# EAGLE schematic untitled2 (EAGLE 9.6.1)
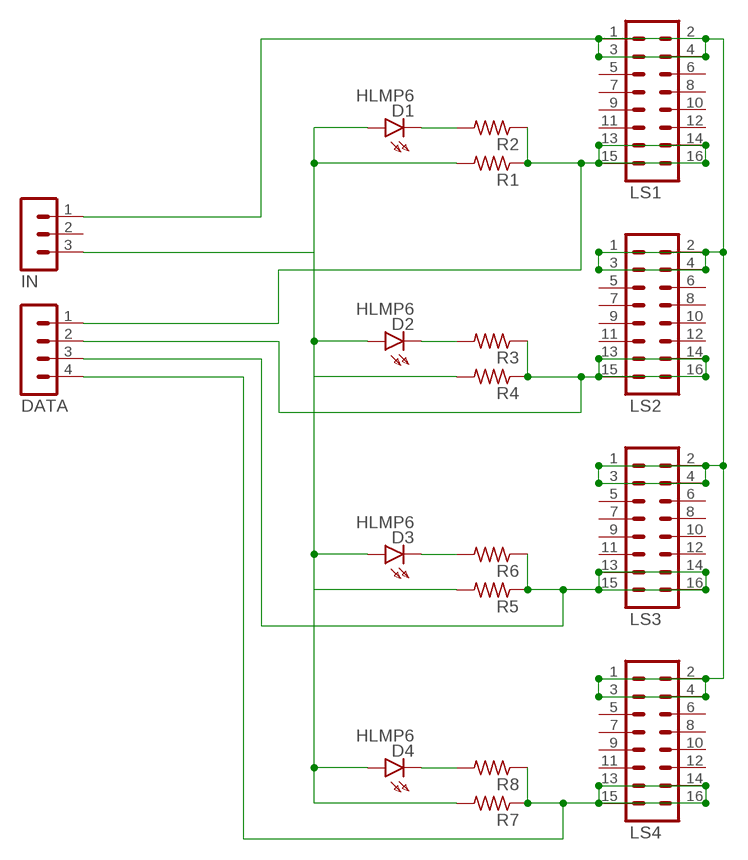
[diagram p0: schematic, sheet 1]

## Parts
D1  HLMP6  [HLMP6]
D2  HLMP6  [HLMP6]
D3  HLMP6  [HLMP6]
D4  HLMP6  [HLMP6]
DATA  MA04-1  [MA04-1]
IN  MA03-1  [MA03-1]
LS1  MA08-2  [MA08-2]
LS2  MA08-2  [MA08-2]
LS3  MA08-2  [MA08-2]
LS4  MA08-2  [MA08-2]
R1  R-US_0207/10  [0207/10]
R2  R-US_0207/10  [0207/10]
R3  R-US_0207/10  [0207/10]
R4  R-US_0207/10  [0207/10]
R5  R-US_0207/10  [0207/10]
R6  R-US_0207/10  [0207/10]
R7  R-US_0207/10  [0207/10]
R8  R-US_0207/10  [0207/10]

## Nets
GND: D1.A D2.A D3.A D4.A IN.3 R1.2 R4.2 R5.2 R7.2
N$1: DATA.1 LS1.13 LS1.14 LS1.15 LS1.16 R1.1 R2.1
N$2: D2.K R3.2
N$3: DATA.2 LS2.13 LS2.14 LS2.15 LS2.16 R3.1 R4.1
N$4: D3.K R6.2
N$5: D1.K R2.2
N$6: DATA.3 LS3.13 LS3.14 LS3.15 LS3.16 R5.1 R6.1
N$7: D4.K R8.2
N$8: DATA.4 LS4.13 LS4.14 LS4.15 LS4.16 R7.1 R8.1
N$9: IN.1 LS1.1 LS1.2 LS1.3 LS1.4 LS2.1 LS2.2 LS2.3 LS2.4 LS3.1 LS3.2 LS3.3 LS3.4 LS4.1 LS4.2 LS4.3 LS4.4
Unconnected: IN.2 LS1.5 LS1.6 LS1.7 LS1.8 LS1.9 LS1.10 LS1.11 LS1.12 LS2.5 LS2.6 LS2.7 LS2.8 LS2.9 LS2.10 LS2.11 LS2.12 LS3.5 LS3.6 LS3.7 LS3.8 LS3.9 LS3.10 LS3.11 LS3.12 LS4.5 LS4.6 LS4.7 LS4.8 LS4.9 LS4.10 LS4.11 LS4.12

## Library data of the parts
D1-D4 = display-hp:HLMP6: LED 2mm horizontal; MF: AGILENT TECHNOLOGIES; MPN: HLMP-6500; OC_FARNELL: 1652490; OC_NEWARK: 40K0088
DATA = con-lstb:MA04-1: PIN HEADER; OC_FARNELL: unknown; OC_NEWARK: unknown
IN = con-lstb:MA03-1: PIN HEADER; OC_FARNELL: unknown; OC_NEWARK: unknown
LS1-LS4 = con-lstb:MA08-2: PIN HEADER; OC_FARNELL: unknown; OC_NEWARK: unknown
R1-R8 = rcl:R-US_: RESISTOR, American symbol; SPICEPREFIX: R